# EasyEDA schematic SCH_sunbeam-card_2026-07-29.json
TITLE: Sheet_1; REV: 1.0; Date: 2026-07-22; Sheet: 1/1; Drawn By: candy1; Company: Your Company
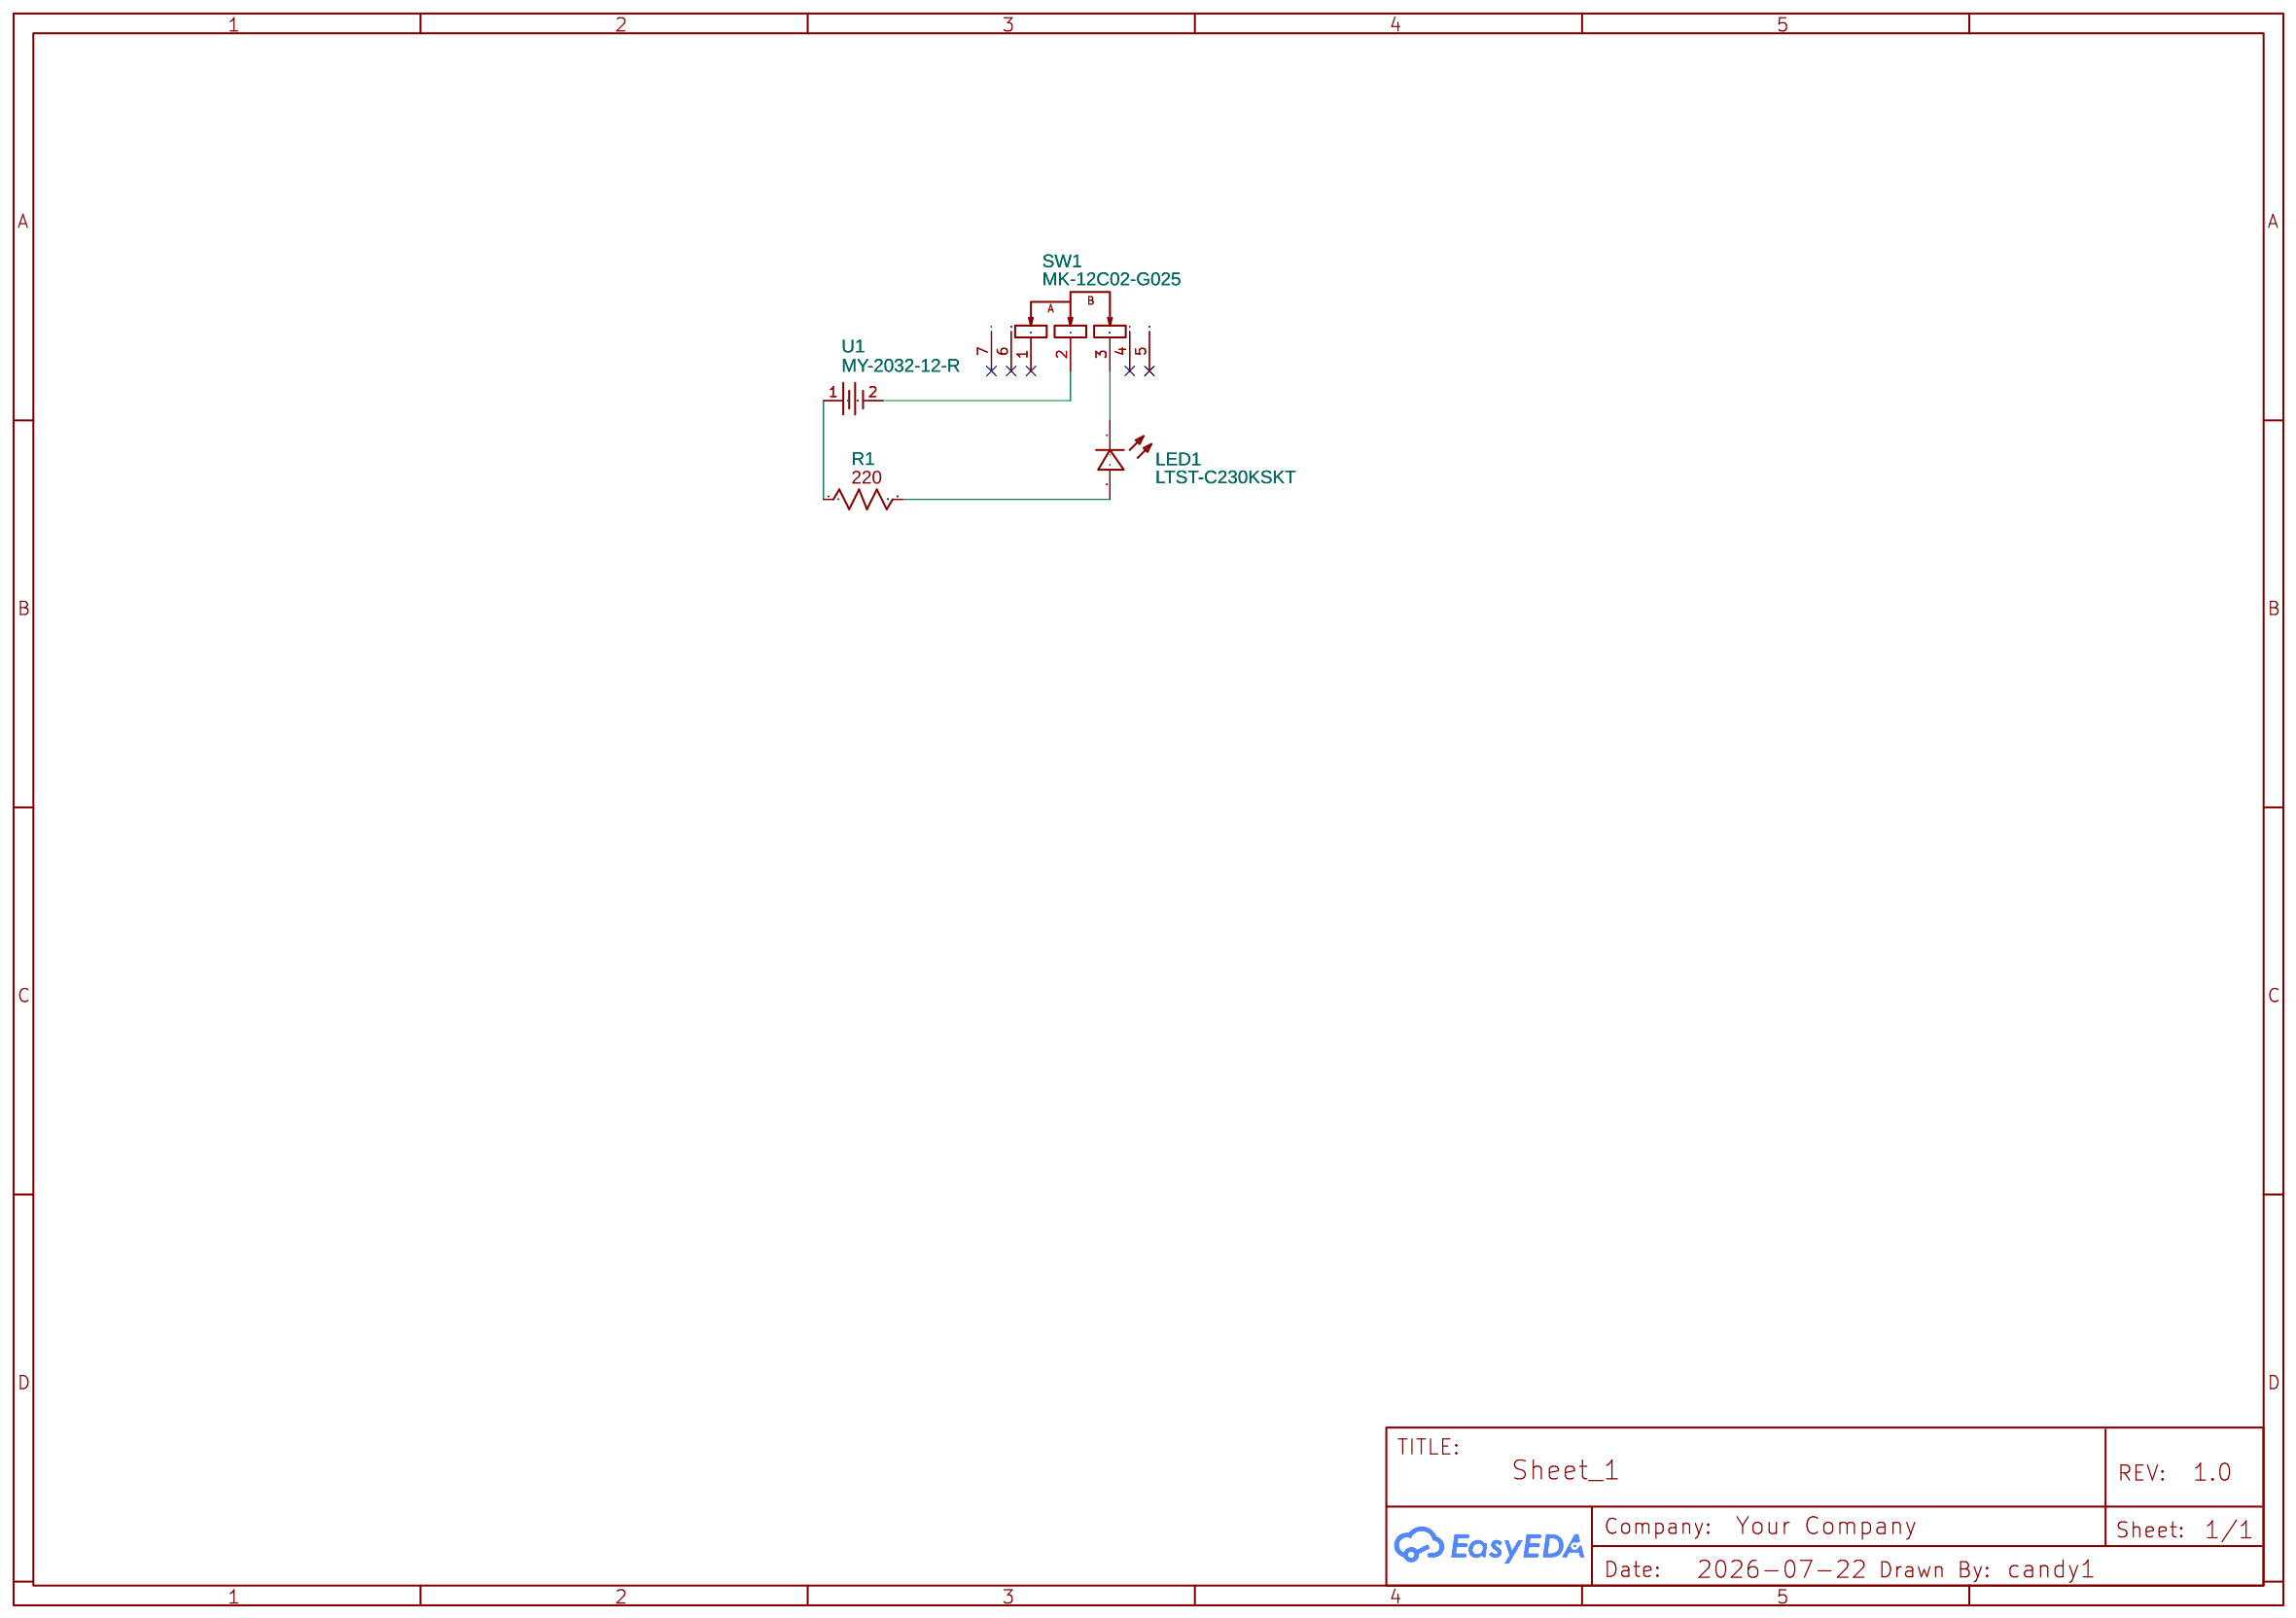
[diagram p0: schematic sheet]

## Parts
LED1  LTST-C230KSKT  [LED1206-RD_YELLOW-SIDE]
R1  220 Ohm (0603)  [20K OHM RESISTOR (0603) SMD - CRCW060320K0FKEAC]
SW1  MK-12C02-G025  [SW-SMD_MK-12C02-G025]
U1  MY-2032-12-R  [BAT-SMD_MY-2032-12]

## Library data of the parts
LED1 = LTST-C230KSKT: Contributor: LCSC; Supplier: LCSC; Supplier Part: C125108; Manufacturer: LITEON(光宝); JLCPCB Part Class: Extended Part
R1 = 20k Ohm Resistor (0603) SMD - CRCW060320K0FKEAC: Manufacturer: Vishay/Dale; Manufacturer Part: 71-CRCW060320K0FKEAC; Supplier: Mouser; Supplier Part: CRCW060320K0FKEAC; link: https://www.mouser.com/datasheet/2/427/crcwce3-1223726.pdf; Contributor: agupta
SW1 = MK-12C02-G025: Contributor: LCSC; Supplier: LCSC; Supplier Part: C778186; Manufacturer: G-Switch(品赞); JLCPCB Part Class: Extended Part
U1 = MY-2032-12-R: Supplier: LCSC; Supplier Part: C964834; Manufacturer: MYOUNG(美阳); JLCPCB Part Class: Extended Part; Contributor: lcsc

## Nets
Net-(LED1-1): LED1.1(-) SW1.3
Net-(LED1-2): LED1.2(+) R1.2
Net-(R1-1): R1.1 U1.1(BAT+)
Net-(SW1-2): SW1.2 U1.2(BAT-)

Not connected (* = marked no-connect by the designer): SW1 1* 4* 5* 6* 7*
